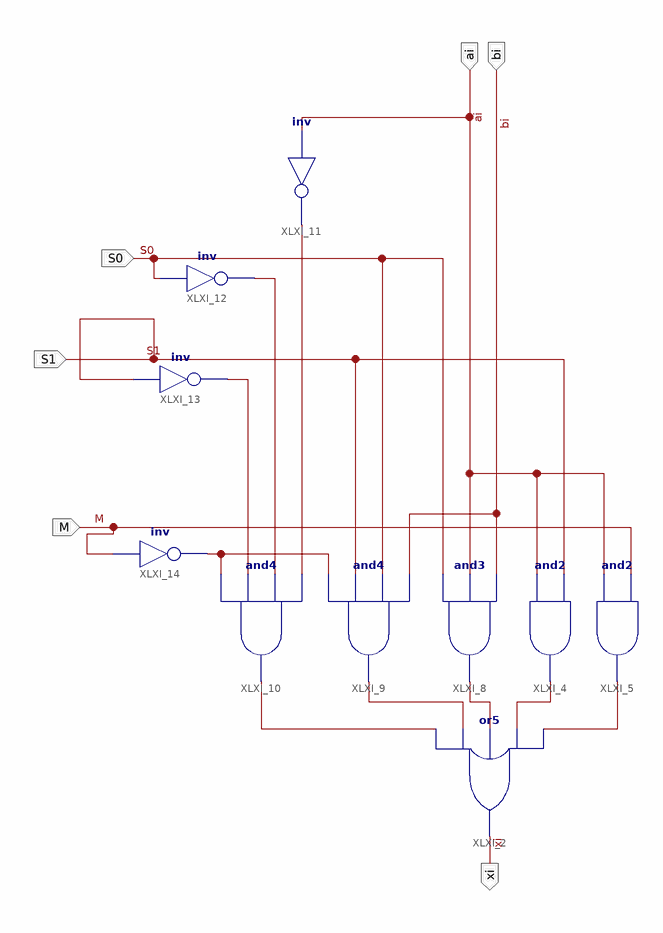
[diagram p0: schematic sheet 1]
// Xilinx ISE schematic logic_ext.sch (spartan3e) as structural Verilog: 10 symbols, 6 ports
module logic_ext (
  input  ai,
  input  bi,
  input  S0,
  input  S1,
  input  M,
  output xi
);

  wire XLXN_1, XLXN_2, XLXN_3, XLXN_4, XLXN_5, XLXN_9, XLXN_15, XLXN_18, XLXN_26;

  or XLXI_2 (xi, XLXN_1, XLXN_2, XLXN_3, XLXN_4, XLXN_5);
  and XLXI_4 (XLXN_4, ai, S1);
  and XLXI_5 (XLXN_5, ai, M);
  and XLXI_8 (XLXN_3, S0, ai, bi);
  and XLXI_9 (XLXN_2, XLXN_26, S1, S0, bi);
  and XLXI_10 (XLXN_1, XLXN_26, XLXN_18, XLXN_15, XLXN_9);
  not XLXI_11 (XLXN_9, ai);
  not XLXI_12 (XLXN_15, S0);
  not XLXI_14 (XLXN_26, M);
  not XLXI_13 (XLXN_18, S1);
endmodule
